# EAGLE design MOAC (EAGLE 9.6.1)
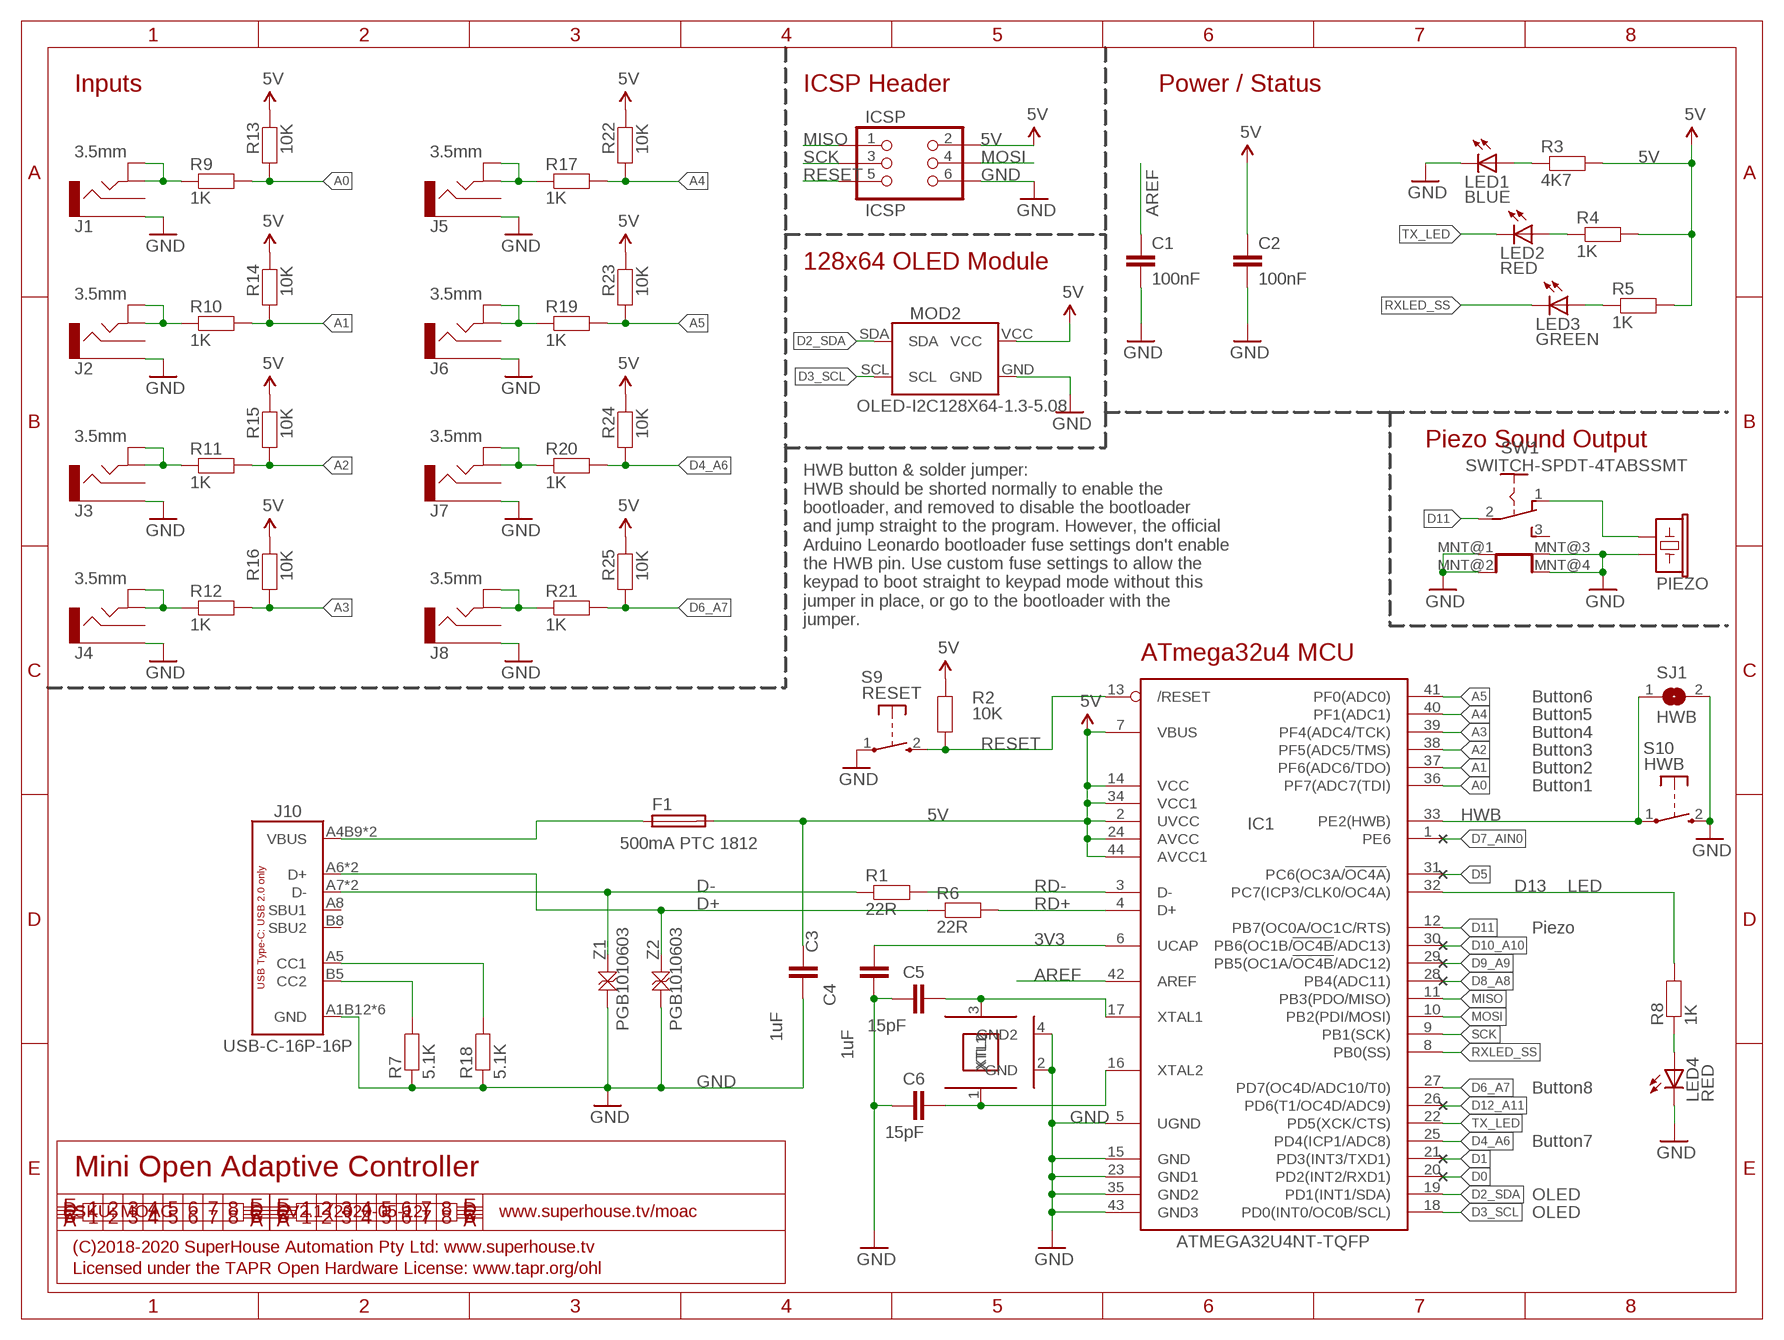
[diagram p0: schematic, sheet 1]

## Parts
C1  100nF  CAP0603  [C0603]
C2  100nF  CAP0603  [C0603]
C3  1uF  CAP0805  [C0805]
C4  1uF  CAP0603  [C0603]
C5  15pF  CAP0603  [C0603]
C6  15pF  CAP0603  [C0603]
F1  500mA PTC 1812  PTC050  [1812]
IC1  ATMEGA32U4NT-TQFP  [TQFP44]
ICSP  ICSP  ICSPPTH  [2X03PTH]
J1  3.5mm  AUDIO-JACK-PJ321  [AUDIO-JACK-PJ321]
J2  3.5mm  AUDIO-JACK-PJ321  [AUDIO-JACK-PJ321]
J3  3.5mm  AUDIO-JACK-PJ321  [AUDIO-JACK-PJ321]
J4  3.5mm  AUDIO-JACK-PJ321  [AUDIO-JACK-PJ321]
J5  3.5mm  AUDIO-JACK-PJ321  [AUDIO-JACK-PJ321]
J6  3.5mm  AUDIO-JACK-PJ321  [AUDIO-JACK-PJ321]
J7  3.5mm  AUDIO-JACK-PJ321  [AUDIO-JACK-PJ321]
J8  3.5mm  AUDIO-JACK-PJ321  [AUDIO-JACK-PJ321]
J10  USB-C-16P-16P  [USB-C-16P]
LED1  BLUE  LED0603  [LED-0603]
LED2  RED  LED0603  [LED-0603]
LED3  GREEN  LED0603  [LED-0603]
LED4  RED  LED0603  [LED-0603]
MOD2  OLED-I2C128X64-1.3-5.08  [OLED-128X64-1.3-5.08]
PIEZO  BUZZERSMD12X12  [BUZZER-12X12-SMT]
R1  22R  RESISTOR0603  [R0603]
R2  10K  RESISTOR0603  [R0603]
R3  4K7  RESISTOR0603  [R0603]
R4  1K  RESISTOR0603  [R0603]
R5  1K  RESISTOR0603  [R0603]
R6  22R  RESISTOR0603  [R0603]
R7  5.1K  RESISTOR0603  [R0603]
R8  1K  RESISTOR0603  [R0603]
R9  1K  RESISTOR0603  [R0603]
R10  1K  RESISTOR0603  [R0603]
R11  1K  RESISTOR0603  [R0603]
R12  1K  RESISTOR0603  [R0603]
R13  10K  RESISTOR0603  [R0603]
R14  10K  RESISTOR0603  [R0603]
R15  10K  RESISTOR0603  [R0603]
R16  10K  RESISTOR0603  [R0603]
R17  1K  RESISTOR0603  [R0603]
R18  5.1K  RESISTOR0603  [R0603]
R19  1K  RESISTOR0603  [R0603]
R20  1K  RESISTOR0603  [R0603]
R21  1K  RESISTOR0603  [R0603]
R22  10K  RESISTOR0603  [R0603]
R23  10K  RESISTOR0603  [R0603]
R24  10K  RESISTOR0603  [R0603]
R25  10K  RESISTOR0603  [R0603]
S9  RESET  TAC_SWITCH_2PINSMT  [TACTILE_SMD_3X4X2]
S10  HWB  TAC_SWITCH_2PINSMT  [TACTILE_SMD_3X4X2]
SJ1  HWB  SJ-NORMAL  [SJ]
SW1  SWITCH-SPDT-4TABSSMT  [MK-12C02]
XTL1  16MHz  CRYSTAL-GND3X2  [CRYSTAL-SMD-3X2]
Z1  PGB1010603  TVS0603  [TVS0603]
Z2  PGB1010603  TVS0603  [TVS0603]

## Nets
3V3: C4.2 IC1.6(UCAP)
5V: C2.1 C3.1 F1.2 IC1.2(UVCC) IC1.7(VBUS) IC1.14(VCC) IC1.24(AVCC) IC1.34(VCC1) IC1.44(AVCC1) ICSP.2 MOD2.VCC R2.2 R3.2 R4.2 R5.2 R13.2 R14.2 R15.2 R16.2 R22.2 R23.2 R24.2 R25.2
A0: IC1.36(PF7(ADC7(TDI)) R9.2 R13.1
A1: IC1.37(PF6(ADC6/TDO)) R10.2 R14.1
A2: IC1.38(PF5(ADC5/TMS)) R11.2 R15.1
A3: IC1.39(PF4(ADC4/TCK)) R12.2 R16.1
A4: IC1.40(PF1(ADC1)) R17.2 R22.1
A5: IC1.41(PF0(ADC0)) R19.2 R23.1
AREF: C1.1 IC1.42(AREF)
D0: IC1.20(PD2(INT2/RXD1))
D1: IC1.21(PD3(INT3/TXD1))
D2_SDA: IC1.19(PD1(INT1/SDA)) MOD2.SDA
D3_SCL: IC1.18(PD0(INT0/OC0B/SCL)) MOD2.SCL
D4_A6: IC1.25(PD4(ICP1/ADC8)) R20.2 R24.1
D5: IC1.31(PC6(OC3A/!OC4A!))
D6_A7: IC1.27(PD7(OC4D/ADC10/T0)) R21.2 R25.1
D7_AIN0: IC1.1(PE6)
D8_A8: IC1.28(PB4(ADC11))
D9_A9: IC1.29(PB5(OC1A/!OC4B!/ADC12))
D10_A10: IC1.30(PB6(OC1B/!OC4B!/ADC13))
D11: IC1.12(PB7(OC0A/OC1C/RTS)) SW1.2(COM)
D12_A11: IC1.26(PD6(T1/OC4D/ADC9))
D13: IC1.32(PC7(ICP3/CLK0/OC4A)) R8.2
D+: J10.A6(D+) J10.B6(D+) R6.1 Z2.2
D-: J10.A7(D-) J10.B7(D-) R1.1 Z1.2
GND: C1.2 C2.2 C3.2 C4.1 C5.1 C6.1 IC1.5(UGND) IC1.15(GND) IC1.23(GND1) IC1.35(GND2) IC1.43(GND3) ICSP.6 J1.3 J2.3 J3.3 J4.3 J5.3 J6.3 J7.3 J8.3 J10.A1B12(GND) J10.A12B1(GND) J10.FIX1(GND) J10.FIX2(GND) J10.FIX3(GND) J10.FIX4(GND) LED1.C LED4.C MOD2.GND PIEZO.1 R7.1 R18.1 S9.1(P) S10.2(S) SJ1.2 SW1.MNT@1(MNT) SW1.MNT@2(MNT) SW1.MNT@3(MNT) SW1.MNT@4(MNT) XTL1.2(GND) XTL1.4(GND2) Z1.1 Z2.1
HWB: IC1.33(PE2(HWB)) S10.1(P) SJ1.1
MISO: IC1.11(PB3(PDO/MISO)) ICSP.1
MOSI: IC1.10(PB2(PDI/MOSI)) ICSP.4
N$1: J10.B5(CC2) R7.2
N$2: LED4.A R8.1
N$3: J1.4A J1.4B R9.1
N$4: J2.4A J2.4B R10.1
N$5: J3.4A J3.4B R11.1
N$6: LED1.A R3.1
N$7: LED2.A R4.1
N$8: LED3.A R5.1
N$9: J4.4A J4.4B R12.1
N$10: J5.4A J5.4B R17.1
N$11: C5.2 IC1.17(XTAL1) XTL1.3(XTL2)
N$12: C6.2 IC1.16(XTAL2) XTL1.1(XTL1)
N$13: J6.4A J6.4B R19.1
N$14: J7.4A J7.4B R20.1
N$15: J8.4A J8.4B R21.1
N$16: PIEZO.2 SW1.1(A)
N$17: J10.A5(CC1) R18.2
RD+: IC1.4(D+) R6.2
RD-: IC1.3(D-) R1.2
RESET: IC1.13(/RESET) ICSP.5 R2.1 S9.2(S)
RXLED_SS: IC1.8(PB0(SS)) LED3.C
SCK: IC1.9(PB1(SCK)) ICSP.3
TX_LED: IC1.22(PD5(XCK/CTS)) LED2.C
USB+: F1.1 J10.A4B9(VBUS) J10.A9B4(VBUS)
Unconnected: J1.2 J2.2 J3.2 J4.2 J5.2 J6.2 J7.2 J8.2 J10.A8(SBU1) J10.B8(SBU2) SW1.3(B)

## Notes on the sheet
- Inputs | ICSP Header | Power / Status
- 128x64 OLED Module
- Piezo Sound Output
- HWB button & solder jumper:
  HWB should be shorted normally to enable the
  bootloader, and removed to disable the bootloader
  and jump straight to the program. However, the official
  Arduino Leonardo bootloader fuse settings don't enable
  the HWB pin. Use custom fuse settings to allow the
  keypad to boot straight to keypad mode without this
  jumper in place, or go to the bootloader with the
  jumper.
- ATmega32u4 MCU
- Button6
- Button5
- Button4
- Button3
- Button2
- Button1
- LED
- Piezo
- Button8
- Button7
- Mini Open Adaptive Controller
- OLED
- OLED
- SKU: MOAC | V2.1 (2020-05-12) | www.superhouse.tv/moac
- (C)2018-2020 SuperHouse Automation Pty Ltd: www.superhouse.tv
- Licensed under the TAPR Open Hardware License: www.tapr.org/ohl

## Library data of the parts
C1-C6 = SuperHouse-DiscreteSemi:CAP: Capacitor Standard ceramic capacitor
F1 = SuperHouse-Fuses:PTC: MF-SMDF Series - PRC Resettable Fuses Source: http://www.farnell.com/datasheets/716597.pdf
IC1 = SuperHouse-MCUs:ATMEGA32U4NT: ATmega32u4 MCU
ICSP = SuperHouse-Connectors:ICSP
J1-J8 = SuperHouse-Connectors:AUDIO-JACK-PJ321
J10 = SuperHouse-Connectors:USB-C-16P: USB-C socket with 16 pins, suitable only for backward compatibility with USB 2
LED1-LED4 = SuperHouse-LEDs:LED: LEDs Standard schematic elements and footprints for 5mm, 3mm, 1206, and 0603 sized LEDs. 5mm - Spark Fun Electronics SKU : COM-00529 (and others)
MOD2 = SuperHouse-Displays:OLED-I2C: OLED module with SSD1306 I2C driver
PIEZO = SuperHouse-Audio:BUZZER: Buzzer - Piezo Transducer
R1-R25 = SuperHouse-DiscreteSemi:RESISTOR: Resistor Standard resistors.
S9 S10 = SuperHouse-Switches:TAC_SWITCH_2PIN: Momentary Tactile Switch - 2 pin Uxcell 3x4x2mm switch with 2 SMT pads
SJ1 = SuperHouse-Jumpers:SJ: SMD solder jumper, normally-open. Add solder to close the connection.
SW1 = SuperHouse-Switches:SWITCH-SPDT-4TABS
XTL1 = SuperHouse-Oscillators:CRYSTAL-GND: 3x2mm SMT crystal
Z1 Z2 = SuperHouse-DiscreteSemi:TVS: TVS voltage protection Zener

## Net classes
0 default: width 0.152 mm, drill 0.241 mm, clearance 0.152 mm

## Board
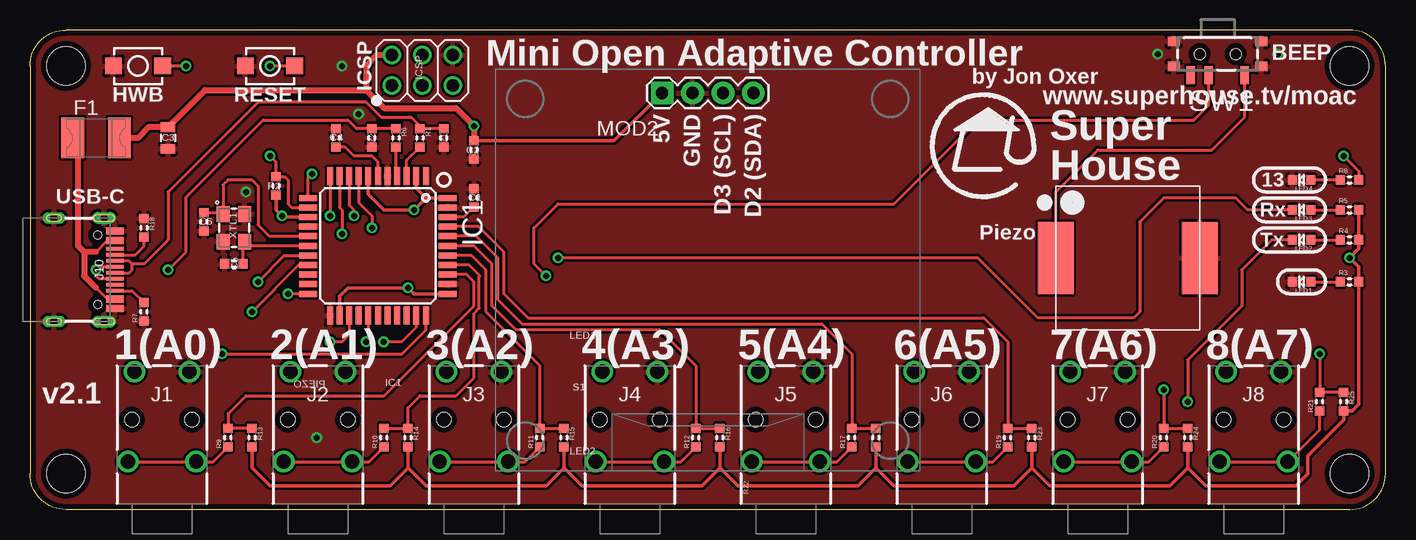
[diagram p1: board, top side]
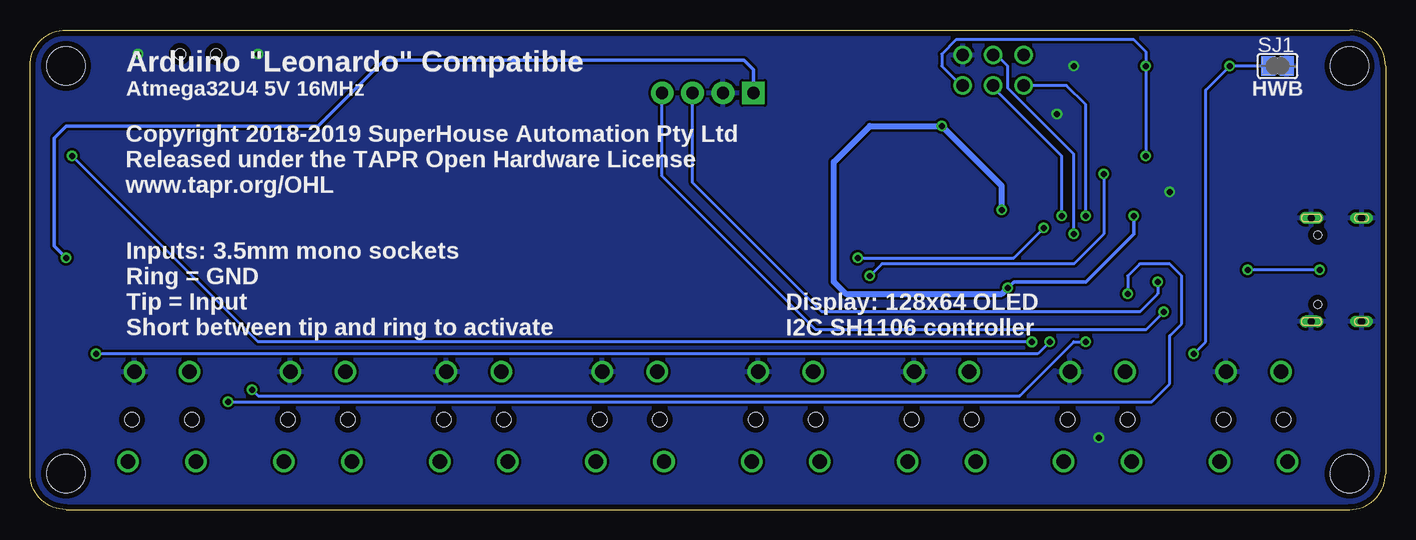
[diagram p2: board, bottom side, seen from below]

Size 113 x 40 mm. Coordinates in mm from the lower left corner, seen from the top.
Outline: 113,3 113,37 arc90 110,40 3,40 arc90 0,37 0,3 arc90 3,0 110,0 arc90 113,3
Copper layers (1*16): Top 0.035mm / dielectric 1.5mm / Bottom 0.035mm
Design rules "SuperHouse-Design-Rules": minimum track width 10mil, minimum drill 24mil, track to track 8mil, track to pad 8mil, pad to pad 8mil, via to via 8mil, smd to smd 6mil, copper to edge 18mil, drill to drill 8mil, minimum pad ring 7mil, minimum via ring 8mil, stop-mask expansion 4mil, vias tented up to drill 0.5mm, thermal gap 10mil
Holes 3.2 mm at 3,3 3,37 110,3 110,37

### Footprints (pad centres in the part's own frame; a part is rotated, then mirrored left to right if it is on the bottom)
C0603 = smd 0.762 x 0.762: 1 -0.762,0; 2 0.762,0
C0805 = smd 0.8 x 1.2: 1 -0.9,0; 2 0.9,0
1812 = smd 1.9 x 3.4: 1 -1.95,0; 2 1.95,0
TQFP44 = smd 1.5 x 0.5: 1 -5.8,4; 2 -5.8,3.2; 3 -5.8,2.4; 4 -5.8,1.6; 5 -5.8,0.8; 6 -5.8,0; 7 -5.8,-0.8; 8 -5.8,-1.6; 9 -5.8,-2.4; 10 -5.8,-3.2; 11 -5.8,-4; 23 5.8,-4; 24 5.8,-3.2; 25 5.8,-2.4; 26 5.8,-1.6; 27 5.8,-0.8; 28 5.8,0; 29 5.8,0.8; 30 5.8,1.6; 31 5.8,2.4; 32 5.8,3.2; 33 5.8,4 | smd 0.5 x 1.5: 12 -4,-5.8; 13 -3.2,-5.8; 14 -2.4,-5.8; 15 -1.6,-5.8; 16 -0.8,-5.8; 17 0,-5.8; 18 0.8,-5.8; 19 1.6,-5.8; 20 2.4,-5.8; 21 3.2,-5.8; 22 4,-5.8; 34 4,5.8; 35 3.2,5.8; 36 2.4,5.8; 37 1.6,5.8; 38 0.8,5.8; 39 0,5.8; 40 -0.8,5.8; 41 -1.6,5.8; 42 -2.4,5.8; 43 -3.2,5.8; 44 -4,5.8
2X03PTH = drill 1.016: 1 -2.54,-1.27; 2 -2.54,1.27; 3 0,-1.27; 4 0,1.27; 5 2.54,-1.27; 6 2.54,1.27
AUDIO-JACK-PJ321 = drill 1.2: 2 -2.3,7.5; 3 2.3,7.5; 4A -2.85,0; 4B 2.85,0 | hole 1.2: -2.5,3.5; 2.5,3.5
USB-C-16P = smd 0.6 x 1.45: A1B12 -3.225,5.095; A4B9 -2.45,5.095; A9B4 2.45,5.095; A12B1 3.225,5.095 | smd 0.3 x 1.45: A5 -1.25,5.095; A6 -0.25,5.095; A7 0.25,5.095; A8 1.25,5.095; B5 1.75,5.095; B6 0.75,5.095; B7 -0.75,5.095; B8 -1.75,5.095 | drill 0.6 pad 0.8 long: FIX1 -4.32,0; FIX4 4.32,0 | drill 0.6 pad 1 long: FIX2 -4.32,4.18; FIX3 4.32,4.18 | hole 0.65: 2.89,3.65; -2.89,3.65
LED-0603 = smd 0.762 x 0.762: A -0.762,0; C 0.762,0
OLED-128X64-1.3-5.08 = drill 1.016 pad 1.88: GND -1.27,14.75; SCL 1.27,14.75; SDA 3.81,14.75 | drill 1.016 pad 1.88 square: VCC -3.81,14.75
BUZZER-12X12-SMT = smd 3 x 6: 1 -6,0; 2 6,0
R0603 = smd 0.762 x 0.762: 1 -0.762,0; 2 0.762,0
TACTILE_SMD_3X4X2 = smd 1.4 x 1.4: 1 -2.05,0; 2 2.05,0
SJ = smd 1.168 x 1.6: 1 -0.762,0; 2 0.762,0
MK-12C02 = smd 0.7 x 1.5: 1 -2.25,1.75; 2 0.75,1.75; 3 2.25,1.75 | smd 1 x 0.8: MNT@1 -3.65,1.05; MNT@2 -3.65,-1.05; MNT@3 3.65,1.05; MNT@4 3.65,-1.05 | hole 0.9: -1.5,0; 1.5,0
CRYSTAL-SMD-3X2 = smd 1.3 x 1.1: 1 -1.15,-0.9; 2 1.15,-0.9; 3 1.15,0.9; 4 -1.15,0.9
TVS0603 = smd 0.762 x 0.762: 1 -0.762,0; 2 0.762,0

### Placement (x,y rotation side)
C1  37,26 90 top
C2  37,30 270 top
C3  11.5,31 270 top
C4  25.5,31 270 top
C5  17,20.5 0 top
C6  14.5,24 90 top
F1  5.5,31 0 top
IC1  29,22 270 top
ICSP  32.7,36.64 0 top
J1  11,4 0 top
J2  24,4 0 top
J3  37,4 0 top
J4  50,4 0 top
J5  63,4 0 top
J6  76,4 0 top
J7  89,4 0 top
J8  102,4 0 top
J10  2,20 270 top
LED1  106,19 180 top
LED2  106,22.5 180 top
LED3  106,25 180 top
LED4  106,27.5 180 top
MOD2  56.5,20 0 top
PIEZO  91.5,21 180 top
R1  32.5,31 270 top
R2  20.5,27 270 top
R3  110,19 0 top
R4  110,22.5 0 top
R5  110,25 0 top
R6  30.5,31 270 top
R7  9.5,16.5 90 top
R8  110,27.5 0 top
R9  16.5,6 90 top
R10  29.5,6 90 top
R11  42.5,6 90 top
R12  55.5,6 90 top
R13  18.5,6 270 top
R14  31.5,6 270 top
R15  44.5,6 270 top
R16  57.5,6 270 top
R17  68.5,6 90 top
R18  9.5,23.5 270 top
R19  81.5,6 90 top
R20  94.5,6 90 top
R21  107.5,9 90 top
R22  70.5,6 270 top
R23  83.5,6 270 top
R24  96.5,6 270 top
R25  109.5,9 270 top
S9  20,37 0 top
S10  9,37 180 top
SJ1  9,37 0 bottom
SW1  99,38 180 top
XTL1  17,23.5 270 top
Z1  34.5,31 90 top
Z2  28.5,31 90 top

### Tracks (layer width: path | path; a pad name or v marks a point on that pad's centre or on a via)
3V3
  Top 0.254: IC1.6 29,29 28.5,29.5 27,29.5 26.26,30.24 C4.2
5V  (via drill 0.5)
  Top 0.305: R5.2 R4.2 110.76,21.76 v110,21 110.76,20.24 R3.2 110.76,8.76 110.24,8.24 R25.2 109.5,7.5 106.5,4.5 106.5,3 105.5,2 98,2 96.5,3.5 | R14.2 31.5,3.5 | 31.5,3.5 30,2 20,2 18.5,3.5 R13.2 | R15.2 44.5,3.5 | 44.5,3.5 43,2 33,2 31.5,3.5 | R16.2 57.5,3.5 | 57.5,3.5 56,2 46,2 44.5,3.5 | R22.2 70.5,3.5 | 70.5,3.5 69,2 59,2 57.5,3.5 | R23.2 83.5,3.5 | 83.5,3.5 82,2 72,2 70.5,3.5 | R24.2 96.5,3.5 | 96.5,3.5 95,2 85,2 83.5,3.5 | C2.1 48.7,30.76 MOD2.VCC | IC1.34 32,18 v31.5,18.5 26.5,18.5 25.8,17.8 IC1.24 | 33,26 v32,25 29.5,25 28.2,26.3 IC1.7 | IC1.44 33,26 | IC1.2 32.2,26.8 33,26 | IC1.14 21.1,24.4 v21,24.5 20.5,25 R2.2
  Top 0.508: ICSP.2 28.91,37.91 28,37 28,35 | 28,35 29.5,33.5 35.5,33.5 v37,32 C2.1 | F1.2 9,31 9.9,31.9 C3.1 14.6,35 28,35
  Bottom 0.305: v21,24.5 21,23 25,19 31,19 v31.5,18.5 | v110,21 111,22 111,31 110,32 89,32 83.5,37.5 53.5,37.5 52.69,36.69 MOD2.VCC
  Bottom 0.508: v31.5,18.5 32,18 45,18 46,19 46,29 43,32 v37,32 32,27 v32,25
A0
  Top 0.254: R13.1 R9.2 16.5,8 18,9.5 29.5,9.5 37,17 37,19 36.4,19.6 IC1.36
A1
  Top 0.254: R10.2 R14.1 31.5,8.5 32.5,9.5 35.5,9.5 37,11 37,16.35 37.46,16.81 37.46,19.46 37.5,19.5 36.6,20.4 IC1.37
A2
  Top 0.254: R15.1 R11.2 42.5,12 38,16.5 38,20 36.8,21.2 IC1.38
A3
  Top 0.254: R16.1 R12.2 55.5,12 52.5,15 40.5,15 38.5,17 38.5,20.5 37,22 IC1.39
A4
  Top 0.254: R22.1 R17.2 68.5,13 66,15.5 41,15.5 39,17.5 39,21 37.2,22.8 IC1.40
A5
  Top 0.254: R23.1 R19.2 81.5,14 79.5,16 41.5,16 39.5,18 39.5,21.5 37.4,23.6 IC1.41
AREF
  Top 0.254: C1.1 36.16,24.4 IC1.42
D2_SDA  (via drill 0.5)
  Top 0.254: IC1.19 22.4,20.4 v18.5,16.5
  Bottom 0.254: v18.5,16.5 20,15 47.5,15 60.31,27.81 MOD2.SDA
D3_SCL  (via drill 0.5)
  Top 0.254: v19,19 21.2,21.2 IC1.18
  Bottom 0.254: v19,19 19,18 20.5,16.5 47,16.5 57.77,27.27 MOD2.SCL
D4_A6  (via drill 0.5)
  Top 0.254: R24.1 R20.2 v94.5,10 | IC1.25 26.6,14.6 26,14 v25,14
  Bottom 0.254: v94.5,10 94,9.5 30.5,9.5 26,14 v25,14
D6_A7  (via drill 0.5)
  Top 0.254: R25.1 R21.2 v107.5,13 | IC1.27 28.2,14.2 v28,14
  Bottom 0.254: v28,14 29,13 v107.5,13
D11  (via drill 0.5)
  Top 0.254: IC1.12 23.2,27.7 v23.5,28 | v43,19.5 42,20.5 42,23.5 44,25.5 72,25.5 79,32.5 97,32.5 98.25,33.75 SW1.2
  Bottom 0.254: v43,19.5 42,20.5 26,20.5 23.5,23 v23.5,28
D13  (via drill 0.5)
  Top 0.254: v109.5,29.5 110.76,28.24 R8.2 | IC1.32 32.2,15.2 30.98,13.98 v29.48,13.98
  Bottom 0.254: v109.5,29.5 93.98,13.98 v29.48,13.98
D+  (via drill 0.5)
  Top 0.254: R6.1 Z2.2 27.24,31.76 26.5,32.5 19.44,32.5 13,26.06 13,21.5 v11.5,20 | J10.B6 5.75,19.25 5.5,19.5 v5.5,20 5.75,20.25 J10.A6
  Bottom 0.254: v5.5,20 v11.5,20
D-
  Top 0.254: Z1.2 R1.1 32.5,32 31.75,32.75 29.25,32.75 28,34 19,34 11.5,26.5 11.5,22.5 9.5,20.5 8.5,20.5 | J10.A7 8.25,19.75 8.5,20 8.5,20.5 | 8.5,20.5 8.25,20.75 J10.B7
GND  (via drill 0.5, 0.5 pad 0.5)
  other vias: 18,26.5 26,37 27.4,33 23.9,6 94,38 104,38
  pour Bottom: 3,0 arc-90 0,3 0,37 arc-90 3,40 110,40 arc-74 113,37 113,3 arc-74 110,0
  pour Top: 3,0 arc-90 0,3 0,37 arc-90 3,40 110,40 arc-74 113,37 113,3 arc-74 110,0
HWB  (via drill 0.5)
  Top 0.254: v13,37 S10.1 | IC1.33 33,15 31,13 v16,13
  Bottom 0.254: SJ1.1 v13,37 15,35 15,14 v16,13
MISO  (via drill 0.5)
  Top 0.254: IC1.11 v25,24.5
  Bottom 0.254: v25,24.5 25,33.78 26.59,35.37 ICSP.1
MOSI  (via drill 0.5)
  Top 0.254: IC1.10 25.8,25.2 26,25 v26,23
  Bottom 0.254: v26,23 26,29.66 31.5,35.16 31.5,37 32.41,37.91 ICSP.4
N$1
  Top 0.254: J10.B5 8.51,18.25 R7.2
N$2
  Top 0.254: R8.1 LED4.A
N$3
  Top 0.254: J1.4A J1.4B 15.26,4 R9.1
N$4
  Top 0.254: J2.4A J2.4B 28.26,4 R10.1
N$5
  Top 0.254: J3.4A J3.4B 41.26,4 R11.1
N$6
  Top 0.254: LED1.A R3.1
N$7
  Top 0.254: LED2.A R4.1
N$8
  Top 0.254: LED3.A R5.1
N$9
  Top 0.254: J4.4A J4.4B 54.26,4 R12.1
N$10
  Top 0.254: J5.4A J5.4B 67.26,4 R17.1
N$11
  Top 0.254: C5.2 17.76,22.21 | 17.76,22.21 XTL1.3 | IC1.17 17.97,22 17.76,22.21
N$12
  Top 0.254: C6.2 16.13,24.76 16.28,24.61 XTL1.1 16.1,27.1 16.5,27.5 18.5,27.5 19,27 19,23.74 19.94,22.8 IC1.16
N$13
  Top 0.254: J6.4A J6.4B 80.26,4 R19.1
N$14
  Top 0.254: J7.4A J7.4B 93.26,4 R20.1
N$15
  Top 0.254: J8.4A J8.4B 107.5,6.65 R21.1
N$16
  Top 0.254: PIEZO.2 85.5,26.5 89,30 98.5,30 101.25,32.75 SW1.1
N$17
  Top 0.254: J10.A5 8.75,21.25 9.5,22 R18.2
RD+
  Top 0.254: IC1.4 30.5,27.9 R6.2
RD-
  Top 0.254: IC1.3 31.4,29.14 R1.2
RESET  (via drill 0.5)
  Top 0.254: S9.2 v20,37 | v20,29.5 20.5,29 R2.1 21.24,27.76 21.5,27.5 21.5,25.5 21.8,25.2 IC1.13
  Bottom 0.254: ICSP.5 35.37,35.37 37,37 37,38 35.8,39.2 21,39.2 20,38.2 v20,37 v20,29.5
RXLED_SS  (via drill 0.5)
  Top 0.254: LED3.C 101.5,25 100.5,26 94.5,26 92.5,24 92.5,16.5 92,16 84,16 79,21 v44,21 | IC1.8 27.4,25.6 28.5,24.5 v28.5,23.5
  Bottom 0.254: v44,21 31,21 v28.5,23.5
SCK  (via drill 0.5)
  Top 0.254: v27,24.5 27,25 26.6,25.4 IC1.9
  Bottom 0.254: v27,24.5 27,29.5 32.7,35.2 ICSP.3
TX_LED  (via drill 0.5)
  Top 0.254: LED2.C 103.5,22.5 101,20 101,17 96.5,12.5 v96.5,9 | IC1.22 v21.5,18
  Bottom 0.254: v96.5,9 19.5,9 18,10.5 18,14.5 17,15.5 17,19.5 18,20.5 20.5,20.5 21.5,19.5 v21.5,18
USB+
  Top 0.254: J10.A4B9 6.45,22.45 5.5,21.5 | J10.A9B4 6.45,17.55 5.5,18.5
  Top 0.508: 4.5,21.5 4,22 4,30.55 F1.1 | 4.5,21.5 4.5,19.5 5.5,18.5 | 5.5,21.5 4.5,21.5

### Text on the board
tPlace: BEEP | ICSP | Mini Open Adaptive Controller | by Jon Oxer | HWB | RESET | www.superhouse.tv/moac | 5V | GND | D3 (SCL) | D2 (SDA) | Super / House | 13 | USB-C | Rx | Piezo | Tx | 1(A0) | 2(A1) | 3(A2) | 4(A3) | 5(A4) | 6(A5) | 7(A6) | 8(A7) | v2.1
bPlace: Arduino "Leonardo" Compatible | HWB | Atmega32U4 5V 16MHz | Copyright 2018-2019 SuperHouse Automation Pty Ltd / Released under the TAPR Open Hardware License / www.tapr.org/OHL | Display: 128x64 OLED / I2C SH1106 controller | Inputs: 3.5mm mono sockets / Ring = GND / Tip = Input / Short between tip and ring to activate
tNames: LED1 | PIEZO | IC1 | S1 | LED2